# EAGLE schematic eeZeeRGBTestJig (EAGLE 6.4)
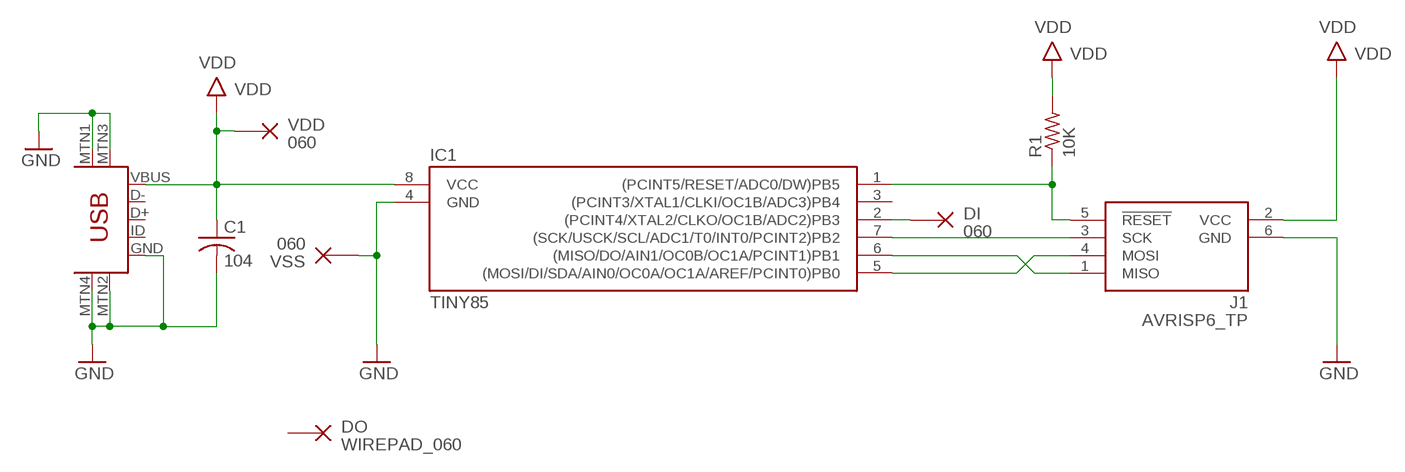
[diagram p0: schematic, sheet 1]

## Parts
C1  104  C-USC0603  [C0603]
DI  060  WIREPAD_060  [PAD_060]
DO  WIREPAD_060  [PAD_060]
IC1  TINY85  TINY25/45/85-20SSU  [SOIC8N]
J1  AVRISP6_TP  [2X3_TP]
R1  10K  R-US_R0603  [R0603]
U$1  USB-MINIB-5PIN  [USB-MINIB]
VDD  060  WIREPAD_060  [PAD_060]
VSS  060  WIREPAD_060  [PAD_060]

## Nets
!RESET: IC1.1((PCINT5/RESET/ADC0/DW)PB5) J1.5(!RESET) R1.1
GND: C1.2 IC1.4(GND) J1.6(GND) U$1.GND U$1.MTN1(MTN2) U$1.MTN2(MTN3) U$1.MTN3(MTN1) U$1.MTN4 VSS.P$1(P)
N$1: IC1.5((MOSI/DI/SDA/AIN0/OC0A/OC1A/AREF/PCINT0)PB0) J1.4(MOSI)
N$2: IC1.6((MISO/DO/AIN1/OC0B/OC1A/PCINT1)PB1) J1.1(MISO)
N$3: IC1.7((SCK/USCK/SCL/ADC1/T0/INT0/PCINT2)PB2) J1.3(SCK)
N$5: DI.P$1(P) IC1.2((PCINT4/XTAL2/CLKO/OC1B/ADC2)PB3)
VDD: C1.1 IC1.8(VCC) J1.2(VCC) R1.2 U$1.VBUS VDD.P$1(P)
Unconnected: DO.P$1(P) IC1.3((PCINT3/XTAL1/CLKI/OC1B/ADC3)PB4) U$1.D+ U$1.D- U$1.ID

## Library data of the parts
C1 = rcl:C-US: CAPACITOR, American symbol
DI DO VDD VSS = bt_electromech:WIREPAD: PIN PAD (PINPAD) Generic pin pad connector
IC1 = bt_avr:TINY25/45/85: Atmel AVR ATiny25,45,85 8-bit Microcontroller
J1 = bt_avr:AVRISP6: 6-pin dual-row connector for Atmel AVRISP programmer interface
R1 = resistor:R-US_: RESISTOR, American symbol
U$1 = SparkFun:USB-MINIB: Mini-USB "B" connector with 5th pin broken out. Created new symbol breaking out 5th "ID" pin in mini/micro USB connector spec. See: http://en.wikipedia.org/wiki/Mini_usb#Cables. Uses same footprint as 4-pin symbol. Also added pins to connect to mounting / shield pads if required (probably not generally needed as signals aren't shielded once they leave the connector).